# EAGLE schematic main (EAGLE 7.2.0)
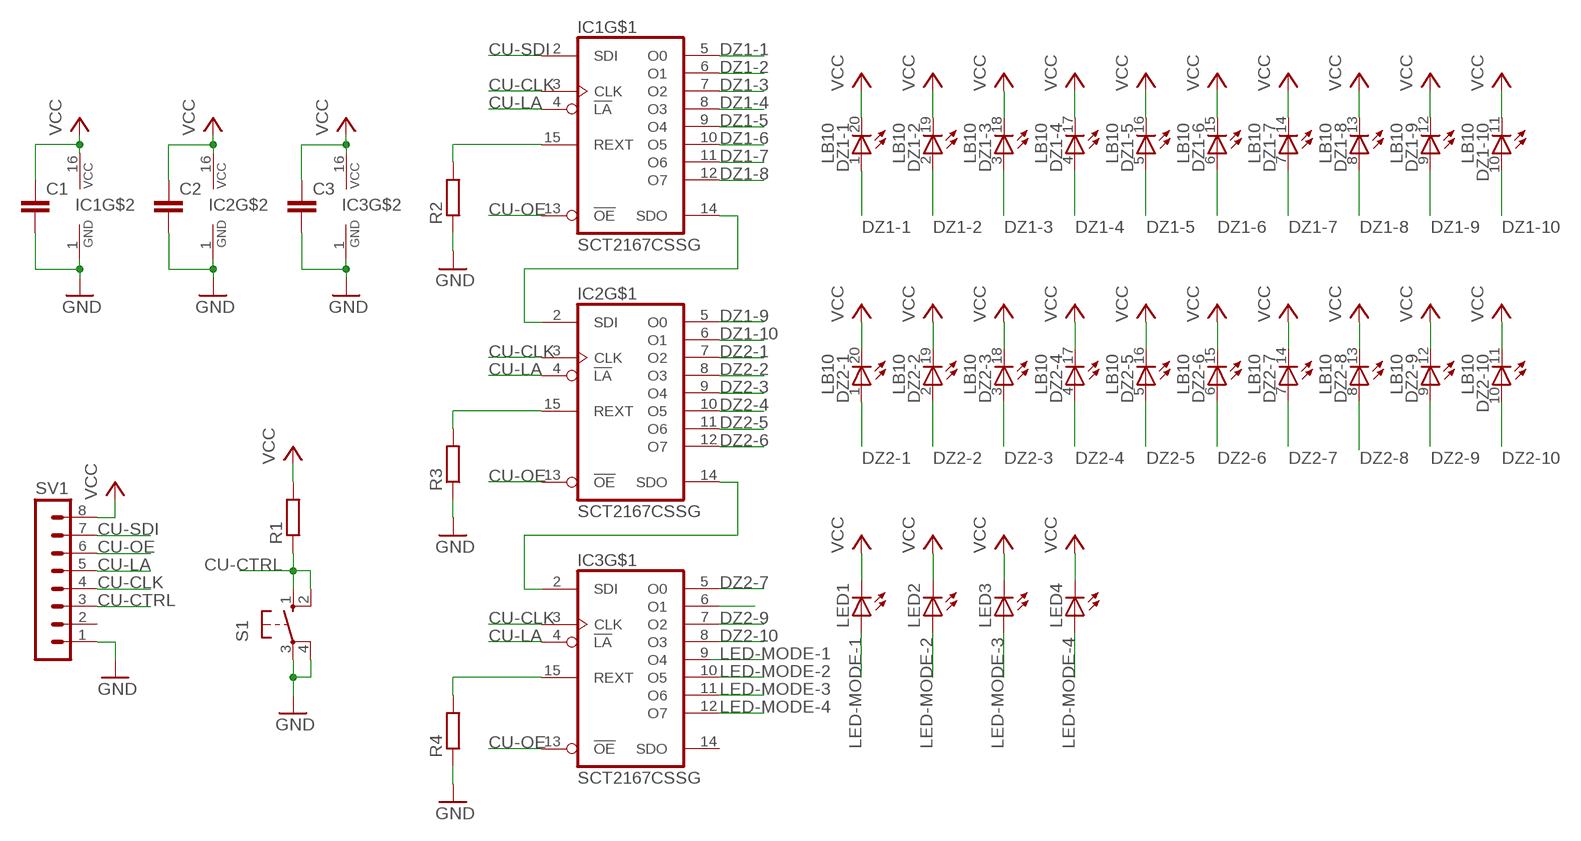
[diagram p0: schematic, sheet 1]

## Parts
C1  C-EUC1206  [C1206]
C2  C-EUC1206  [C1206]
C3  C-EUC1206  [C1206]
DZ1  LB10  [LB10]
DZ2  LB10  [LB10]
IC1  SCT2167CSSG  [SSOP16]
IC2  SCT2167CSSG  [SSOP16]
IC3  SCT2167CSSG  [SSOP16]
LED1  LED3MM  [LED3MM]
LED2  LED3MM  [LED3MM]
LED3  LED3MM  [LED3MM]
LED4  LED3MM  [LED3MM]
R1  R-EU_R1206  [R1206]
R2  R-EU_R1206  [R1206]
R3  R-EU_R1206  [R1206]
R4  R-EU_R1206  [R1206]
S1  10-XX  [B3F-10XX]
SV1  MA08-1  [MA08-1]

## Nets
CU-CLK: IC1.3(CLK) IC2.3(CLK) IC3.3(CLK) SV1.4
CU-CTRL: R1.1 S1.1(S) S1.2(S1) SV1.3
CU-LA: IC1.4(!LA) IC2.4(!LA) IC3.4(!LA) SV1.5
CU-OE: IC1.13(!OE) IC2.13(!OE) IC3.13(!OE) SV1.6
CU-SDI: IC1.2(SDI) SV1.7
DZ1-1: DZ1.1(-1:A) IC1.5(O0)
DZ1-2: DZ1.2(-2:A) IC1.6(O1)
DZ1-3: DZ1.3(-3:A) IC1.7(O2)
DZ1-4: DZ1.4(-4:A) IC1.8(O3)
DZ1-5: DZ1.5(-5:A) IC1.9(O4)
DZ1-6: DZ1.6(-6:A) IC1.10(O5)
DZ1-7: DZ1.7(-7:A) IC1.11(O6)
DZ1-8: DZ1.8(-8:A) IC1.12(O7)
DZ1-9: DZ1.9(-9:A) IC2.5(O0)
DZ1-10: DZ1.10(-10:A) IC2.6(O1)
DZ2-1: DZ2.1(-1:A) IC2.7(O2)
DZ2-2: DZ2.2(-2:A) IC2.8(O3)
DZ2-3: DZ2.3(-3:A) IC2.9(O4)
DZ2-4: DZ2.4(-4:A) IC2.10(O5)
DZ2-5: DZ2.5(-5:A) IC2.11(O6)
DZ2-6: DZ2.6(-6:A) IC2.12(O7)
DZ2-7: DZ2.7(-7:A) IC3.5(O0)
DZ2-8: DZ2.8(-8:A) IC3.6(O1)
DZ2-9: DZ2.9(-9:A) IC3.7(O2)
DZ2-10: DZ2.10(-10:A) IC3.8(O3)
GND: C1.2 C2.2 C3.2 IC1.1(GND) IC2.1(GND) IC3.1(GND) R2.1 R3.1 R4.1 S1.3(P) S1.4(P1) SV1.1
LED-MODE-1: LED1.A
LED-MODE-2: IC3.10(O5) LED2.A
LED-MODE-3: IC3.11(O6) LED3.A
LED-MODE-4: IC3.12(O7) LED4.A
N$3: IC1.14(SDO) IC2.2(SDI)
N$4: IC2.14(SDO) IC3.2(SDI)
N$8: IC1.15(REXT) R2.2
N$13: IC2.15(REXT) R3.2
N$17: IC3.15(REXT) R4.2
VCC: C1.1 C2.1 C3.1 DZ1.11(-10:C) DZ1.12(-9:C) DZ1.13(-8:C) DZ1.14(-7:C) DZ1.15(-6:C) DZ1.16(-5:C) DZ1.17(-4:C) DZ1.18(-3:C) DZ1.19(-2:C) DZ1.20(-1:C) DZ2.11(-10:C) DZ2.12(-9:C) DZ2.13(-8:C) DZ2.14(-7:C) DZ2.15(-6:C) DZ2.16(-5:C) DZ2.17(-4:C) DZ2.18(-3:C) DZ2.19(-2:C) DZ2.20(-1:C) IC1.16(VCC) IC2.16(VCC) IC3.16(VCC) LED1.K(C) LED2.K(C) LED3.K(C) LED4.K(C) R1.2 SV1.8
Unconnected: IC3.9(O4) IC3.14(SDO) SV1.2

## Library data of the parts
C1-C3 = resistor:C-EU: CAPACITOR, European symbol
DZ1 DZ2 = led:LB10: LED BLOCK 10-LED bar graph, DIL, Siemens
IC1-IC3 = starchips:SCT2167
LED1-LED4 = led:LED: LED OSRAM: - CHIPLED LG R971, LG N971, LY N971, LG Q971, LY Q971, LO R971, LY R971 LH N974, LH R974 LS Q976, LO Q976, LY Q976 LO Q996 - Hyper CHIPLED LW Q18S LB Q993, LB Q99A, LB R99A - SideLED LS A670, LO A670, LY A670, LG A670, LP A670 LB A673, LV A673, LT A673, LW A673 LH A674 LY A675 LS A676, LA A676, LO A676, LY A676, LW A676 LS A679, LY A679, LG A679 - Hyper Micro SIDELED® LS Y876, LA Y876, LO Y876, LY Y876 LT Y87S - SmartLED LW L88C, LW L88S LB L89C, LB L89S, LG L890 LS L89K, LO L89K, LY L89K LS L896, LA L896, LO L896, LY L896 - TOPLED LS T670, LO T670, LY T670, LG T670, LP T670 LSG T670, LSP T670, LSY T670, LOP T670, LYG T670 LG T671, LOG T671, LSG T671 LB T673, LV T673, LT T673, LW T673 LH T674 LS T676, LA T676, LO T676, LY T676, LB T676, LH T676, LSB T676, LW T676 LB T67C, LV T67C, LT T67C, LS T67K, LO T67K, LY T67K, LW E67C LS E67B, LA E67B, LO E67B, LY E67B, LB E67C, LV E67C, LT E67C LW T67C LS T679, LY T679, LG T679 LS T770, LO T770, LY T770, LG T770, LP T770 LB T773, LV T773, LT T773, LW T773 LH T774 LS E675, LA E675, LY E675, LS T675 LS T776, LA T776, LO T776, LY T776, LB T776 LHGB T686 LT T68C, LB T68C - Hyper Mini TOPLED® LB M676 - Mini TOPLED Santana® LG M470 LS M47K, LO M47K, LY M47K Source: http://www.osram.convergy.de LUXEON: - LUMILED® LXK2-PW12-R00, LXK2-PW12-S00, LXK2-PW14-U00, LXK2-PW14-V00 LXK2-PM12-R00, LXK2-PM12-S00, LXK2-PM14-U00 LXK2-PE12-Q00, LXK2-PE12-R00, LXK2-PE12-S00, LXK2-PE14-T00, LXK2-PE14-U00 LXK2-PB12-K00, LXK2-PB12-L00, LXK2-PB12-M00, LXK2-PB14-N00, LXK2-PB14-P00, LXK2-PB14-Q00 LXK2-PR12-L00, LXK2-PR12-M00, LXK2-PR14-Q00, LXK2-PR14-R00 LXK2-PD12-Q00, LXK2-PD12-R00, LXK2-PD12-S00 LXK2-PH12-R00, LXK2-PH12-S00 LXK2-PL12-P00, LXK2-PL12-Q00, LXK2-PL12-R00 Source: www.luxeon.com KINGBRIGHT: KA-3528ASYC Source: www.kingbright.com
R1-R4 = resistor:R-EU_: RESISTOR, European symbol
S1 = switch-omron:10-XX: OMRON SWITCH; MPN: B3F-1000; OC_FARNELL: 176432; OC_NEWARK: 36M3542
SV1 = con-lstb:MA08-1: PIN HEADER; OC_FARNELL: unknown; OC_NEWARK: unknown